# Altium project COM.PrjPcb (part 2 of 2)

## Sheet COM-MSP430FR5994.SchDoc: =DocumentName
size B; Date: June 22nd, 2018; Author: Radio Jesus; Engineer: Radio Jesus; Organization: Colorado Space Grant; Revision: A; SheetNumber: 3; SheetTotal: 7; ProjectName: COM-MSP430FR5994.SchDoc
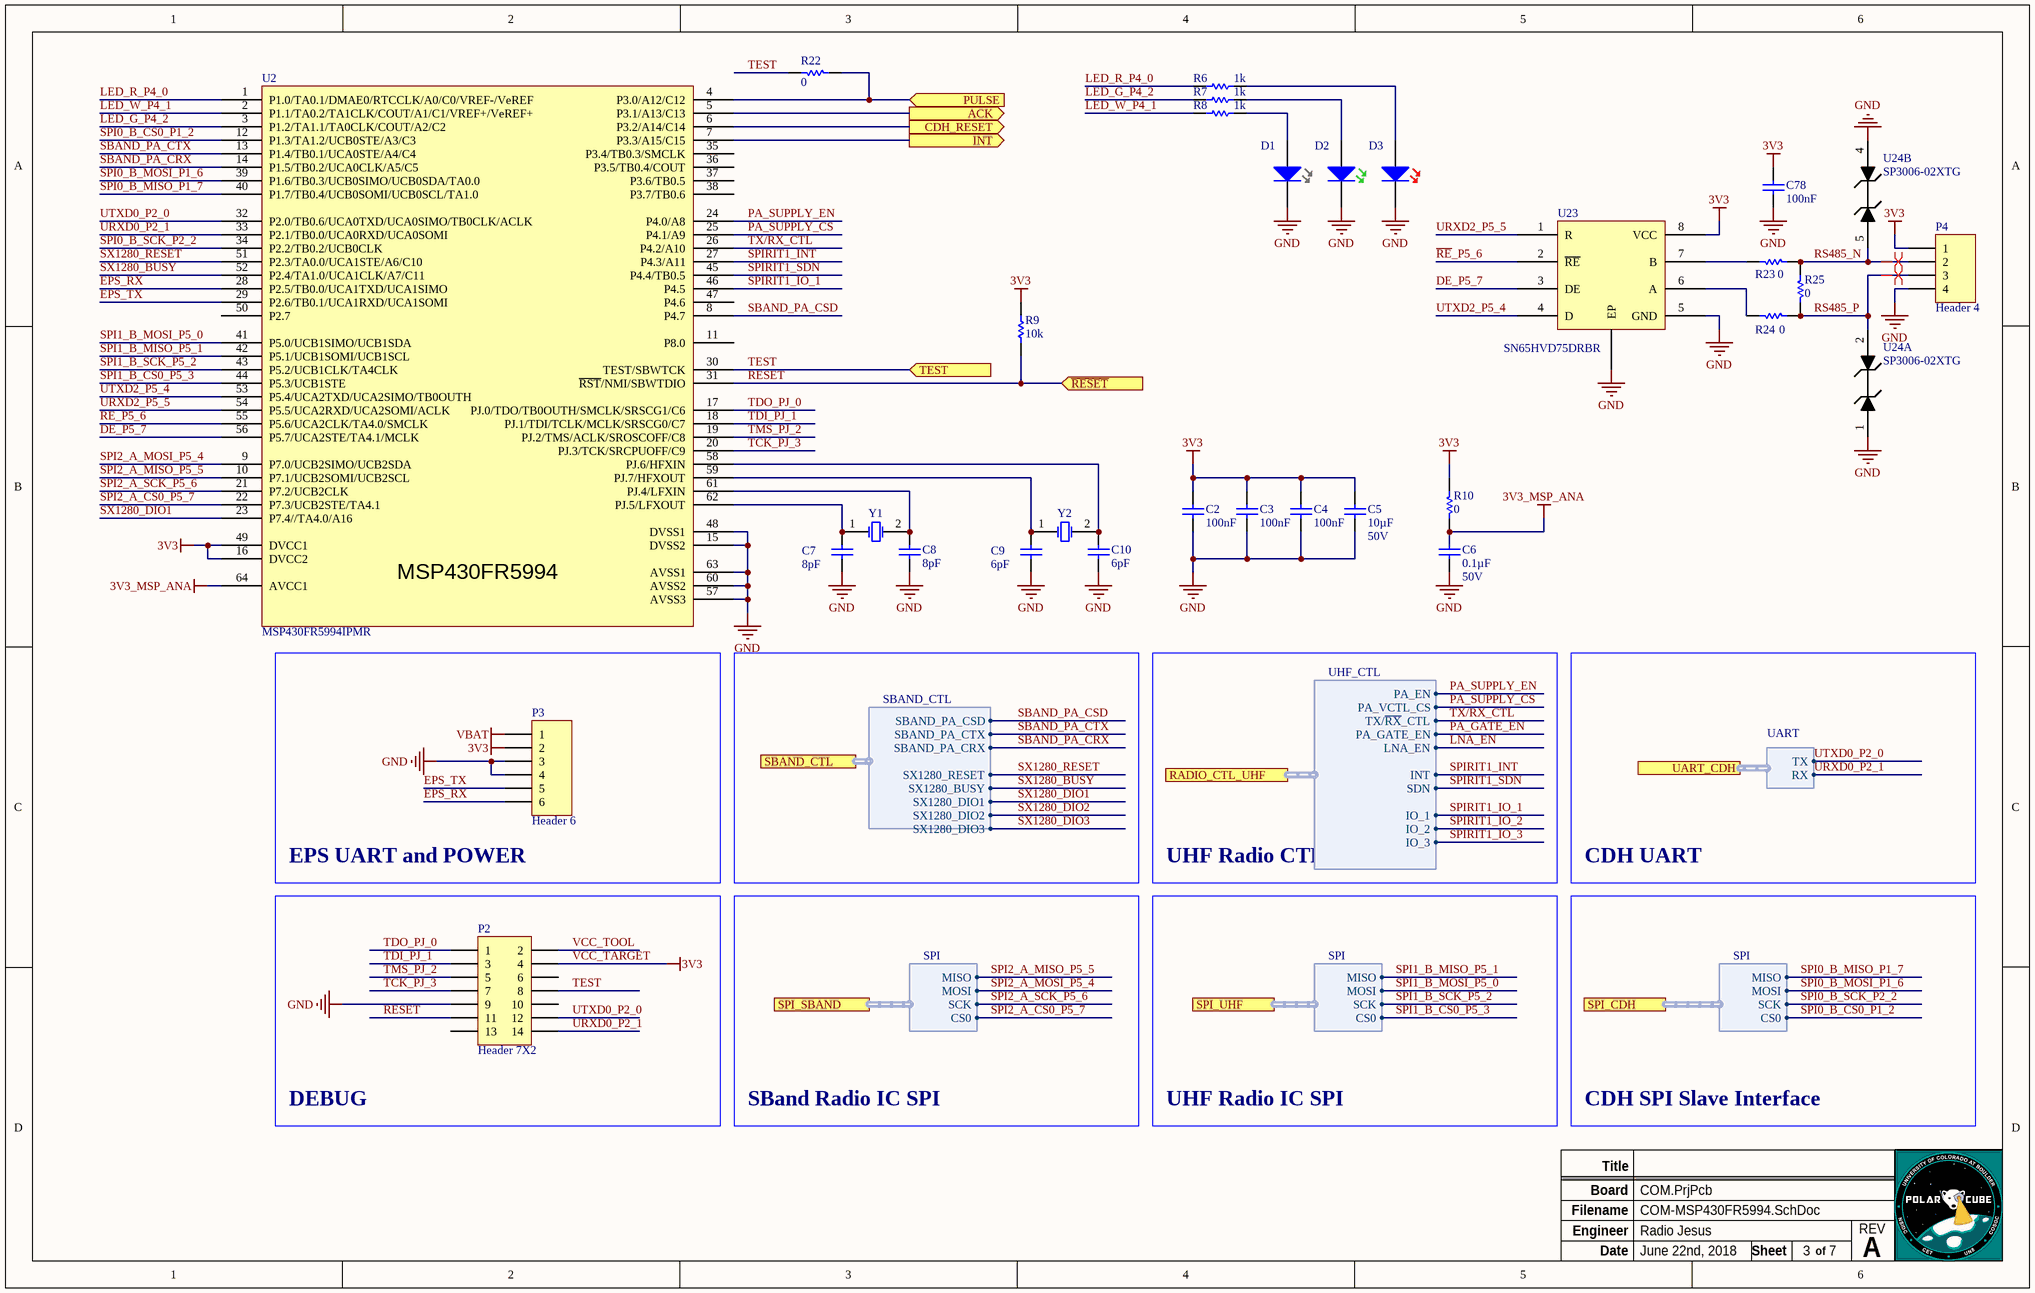
[diagram p6: COM-MSP430FR5994.SchDoc]

### Parts
C2  Capacitance: 100nF  [1608[0603]]  (hidden comment: CL10B104KB8ZW6C)
C3  Capacitance: 100nF  [1608[0603]]  (hidden comment: CL10B104KB8ZW6C)
C4  Capacitance: 100nF  [1608[0603]]  (hidden comment: CL10B104KB8ZW6C)
C5  Capacitance: 10µF  Voltage: 50V  [1608[0603]]  (hidden comment: CL10A106KP8NNNC)
C6  Capacitance: 0.1µF  Voltage: 50V  [1608[0603]]  (hidden comment: CL10B104KB8ZW6C)
C7  Capacitance: 8pF  [1608[0603]]  (hidden comment: CL10C080CB8NNNC)
C8  Capacitance: 8pF  [1608[0603]]  (hidden comment: CL10C080CB8NNNC)
C9  Capacitance: 6pF  [1608[0603]]  (hidden comment: CL10C060CB8NCNC)
C10  Capacitance: 6pF  [1608[0603]]  (hidden comment: CL10C060CB8NCNC)
C78  Capacitance: 100nF  [CAPC0603X03L]  (hidden comment: CL10B104KB8ZW6C)
D1  QBLP601-IW  [1608[0603]]  (value not drawn)
D2  150060VS75000  [1608[0603]]  (value not drawn)
D3  150060RS75000  [1608[0603]]  (value not drawn)
P2  Header 7X2  [MSP430_JTAG_HEADER]
P3  Header 6  [T1M-06-F-SV-L]
P4  Header 4  [FH34SRJ-4S-0.5SH(99)]
R6  Resistance: 1k  [1608[0603]]  (hidden comment: RMCF0603JT1K00)
R7  Resistance: 1k  [1608[0603]]  (hidden comment: RMCF0603JT1K00)
R8  Resistance: 1k  [1608[0603]]  (hidden comment: RMCF0603JT1K00)
R9  Resistance: 10k  [1608[0603]]  (hidden comment: RMCF0603JG10K0)
R10  Resistance: 0  [1608[0603]]  (hidden comment: CRCW06030000Z0EAC)
R22  Resistance: 0  [1608[0603]]  (hidden comment: CRCW06030000Z0EAC)
R23  Resistance: 0  [RESC0603X03N]  (hidden comment: CRCW06030000Z0EAC)
R24  Resistance: 0  [RESC0603X03N]  (hidden comment: CRCW06030000Z0EAC)
R25  Resistance: 0  [RESC0603X03N]  (hidden comment: CRCW06030000Z0EAC)
U2  MSP430FR5994IPMR  [S-PQFP-G64]
U23  SN65HVD75DRBR  [SON65P300X100_HS-9N]
U24  SP3006-02XTG  [SOT50P160X60-6L]  (parts A,B of 2)
Y1  XTAL  [FC-135R]  (value not drawn)
Y2  XTAL  [NX3225GD]  (value not drawn)

### Blocks framed on the sheet
EPS UART and POWER: P3
DEBUG: P2

### Ports
ACK (out), CDH_RESET (out), INT (out), PULSE (in), RADIO_CTL_UHF (harness UHF_CTL), SBAND_CTL (harness SBAND_CTL), SPI_CDH (harness SPI), SPI_SBAND (harness SPI), SPI_UHF (harness SPI), TEST (in), UART_CDH (harness UART), ~{RESET} (in)

### Harnesses
UART: RX, TX
SPI: MISO, MOSI, SCK, CS0
UHF_CTL: PA_EN, PA_VCTL_CS, TX/~{RX}_CTL, INT, SDN, IO_1, IO_2, IO_3, PA_GATE_EN, LNA_EN
SBAND_CTL: SBAND_PA_CSD, SBAND_PA_CTX, SBAND_PA_CRX, SX1280_RESET, SX1280_BUSY, SX1280_DIO1, SX1280_DIO2, SX1280_DIO3

### Nets
3V3: C2.2 C3.2 C4.2 C5.2 C78.2 P2.4 P3.2 P4.1 R9.2 R10.1 U2.16(DVCC2) U2.49(DVCC1) U23.8(VCC)  [also labelled VCC_TARGET]
3V3_MSP_ANA: C6.2 R10.2 U2.64(AVCC1)
GND: C2.1 C3.1 C4.1 C5.1 C6.1 C7.1 C8.1 C9.1 C10.1 C78.1 D1.2(K) D2.2(K) D3.2(K) P2.9 P3.3 P3.4 P4.4 U2.15(DVSS2) U2.48(DVSS1) U2.57(AVSS3) U2.60(AVSS2) U2.63(AVSS1) U23.5(GND) U23.9(EP) U24.1 U24.4
VBAT: P3.1
DE_P5_7: U2.56(P5.7/UCA2STE/TA4.1/MCLK) U23.3(DE)
EPS_RX: P3.6 U2.28(P2.5/TB0.0/UCA1TXD/UCA1SIMO)
EPS_TX: P3.5 U2.29(P2.6/TB0.1/UCA1RXD/UCA1SOMI)
LED_G_P4_2: R7.1 U2.3(P1.2/TA1.1/TA0CLK/COUT/A2/C2)
LED_R_P4_0: R6.1 U2.1(P1.0/TA0.1/DMAE0/RTCCLK/A0/C0/VREF-/VeREF)
LED_W_P4_1: R8.1 U2.2(P1.1/TA0.2/TA1CLK/COUT/A1/C1/VREF+/VeREF+)
PA_SUPPLY_CS: U2.25(P4.1/A9) ; port RADIO_CTL_UHF.PA_VCTL_CS
PA_SUPPLY_EN: U2.24(P4.0/A8) ; port RADIO_CTL_UHF.PA_EN
~{RE}_P5_6: U2.55(P5.6/UCA2CLK/TA4.0/SMCLK) U23.2(~{RE})
~{RESET}: P2.11 R9.1 U2.31(~{RST}/NMI/SBWTDIO) ; port ~{RESET}
RS485_N: P4.2 R23.2 R25.2 U24.5
RS485_P: P4.3 R24.2 R25.1 U24.2
S_ACK: U2.5(P3.1/A13/C13) ; port ACK
S_CDH_RESET: U2.6(P3.2/A14/C14) ; port CDH_RESET
S_INT: U2.7(P3.3/A15/C15) ; port INT
S_PULSE: R22.2 U2.4(P3.0/A12/C12) ; port PULSE
SBAND_PA_CRX: U2.14(P1.5/TB0.2/UCA0CLK/A5/C5) ; port SBAND_CTL.SBAND_PA_CRX
SBAND_PA_CSD: U2.8(P4.7) ; port SBAND_CTL.SBAND_PA_CSD
SBAND_PA_CTX: U2.13(P1.4/TB0.1/UCA0STE/A4/C4) ; port SBAND_CTL.SBAND_PA_CTX
SPI0_B_CS0_P1_2: U2.12(P1.3/TA1.2/UCB0STE/A3/C3) ; port SPI_CDH.CS0  [project net S_CS0]
SPI0_B_MISO_P1_7: U2.40(P1.7/TB0.4/UCB0SOMI/UCB0SCL/TA1.0) ; port SPI_CDH.MISO  [project net S_MISO]
SPI0_B_MOSI_P1_6: U2.39(P1.6/TB0.3/UCB0SIMO/UCB0SDA/TA0.0) ; port SPI_CDH.MOSI  [project net S_MOSI]
SPI0_B_SCK_P2_2: U2.34(P2.2/TB0.2/UCB0CLK) ; port SPI_CDH.SCK  [project net S_SCK]
SPI1_B_CS0_P5_3: U2.44(P5.3/UCB1STE) ; port SPI_UHF.CS0
SPI1_B_MISO_P5_1: U2.42(P5.1/UCB1SOMI/UCB1SCL) ; port SPI_UHF.MISO
SPI1_B_MOSI_P5_0: U2.41(P5.0/UCB1SIMO/UCB1SDA) ; port SPI_UHF.MOSI
SPI1_B_SCK_P5_2: U2.43(P5.2/UCB1CLK/TA4CLK) ; port SPI_UHF.SCK
SPI2_A_CS0_P5_7: U2.22(P7.3/UCB2STE/TA4.1) ; port SPI_SBAND.CS0
SPI2_A_MISO_P5_5: U2.10(P7.1/UCB2SOMI/UCB2SCL) ; port SPI_SBAND.MISO
SPI2_A_MOSI_P5_4: U2.9(P7.0/UCB2SIMO/UCB2SDA) ; port SPI_SBAND.MOSI
SPI2_A_SCK_P5_6: U2.21(P7.2/UCB2CLK) ; port SPI_SBAND.SCK
SPIRIT1_INT: U2.27(P4.3/A11) ; port RADIO_CTL_UHF.INT
SPIRIT1_IO_1: U2.46(P4.5) ; port RADIO_CTL_UHF.IO_1
SPIRIT1_SDN: U2.45(P4.4/TB0.5) ; port RADIO_CTL_UHF.SDN
SX1280_BUSY: U2.52(P2.4/TA1.0/UCA1CLK/A7/C11) ; port SBAND_CTL.SX1280_BUSY
SX1280_DIO1: U2.23(P7.4//TA4.0/A16) ; port SBAND_CTL.SX1280_DIO1
SX1280_RESET: U2.51(P2.3/TA0.0/UCA1STE/A6/C10) ; port SBAND_CTL.SX1280_RESET
TCK_PJ_3: P2.7 U2.20(PJ.3/TCK/SRCPUOFF/C9)
TDI_PJ_1: P2.3 U2.18(PJ.1/TDI/TCLK/MCLK/SRSCG0/C7)
TDO_PJ_0: P2.1 U2.17(PJ.0/TDO/TB0OUTH/SMCLK/SRSCG1/C6)
TEST: P2.8 R22.1 U2.30(TEST/SBWTCK) ; port TEST
TMS_PJ_2: P2.5 U2.19(PJ.2/TMS/ACLK/SROSCOFF/C8)
TX/~{RX}_CTL: U2.26(P4.2/A10) ; port RADIO_CTL_UHF.TX/~{RX}_CTL
URXD0_P2_1: P2.14 U2.33(P2.1/TB0.0/UCA0RXD/UCA0SOMI) ; port UART_CDH.RX  [project net S_RX]
URXD2_P5_5: U2.54(P5.5/UCA2RXD/UCA2SOMI/ACLK) U23.1(R)
UTXD0_P2_0: P2.12 U2.32(P2.0/TB0.6/UCA0TXD/UCA0SIMO/TB0CLK/ACLK) ; port UART_CDH.TX  [project net S_TX]
UTXD2_P5_4: U2.53(P5.4/UCA2TXD/UCA2SIMO/TB0OUTH) U23.4(D)
VCC_TOOL: P2.2
NetC7_2: C7.2 U2.62(PJ.5/LFXOUT) Y1.1(OSC1)
NetC8_2: C8.2 U2.61(PJ.4/LFXIN) Y1.2(OSC2)
NetC9_2: C9.2 U2.59(PJ.7/HFXOUT) Y2.1(OSC1)
NetC10_2: C10.2 U2.58(PJ.6/HFXIN) Y2.2(OSC2)
NetD1_1: D1.1(A) R8.2
NetD2_1: D2.1(A) R7.2
NetD3_1: D3.1(A) R6.2
NetR23_1: R23.1 U23.7(B)
NetR24_1: R24.1 U23.6(A)

Not connected (* = marked no-connect by the designer): P2 6 10 13; U2 11(P8.0) 35(P3.4/TB0.3/SMCLK) 36(P3.5/TB0.4/COUT) 37(P3.6/TB0.5) 38(P3.7/TB0.6) 47(P4.6) 50(P2.7)

### Layout directives
differential pair: RS485_N, RS485_P

### Notes on the sheet
- UHF Radio CTL
- CDH UART
- SBand Radio IC SPI
- UHF Radio IC SPI
- CDH SPI Slave Interface
- Title
- Board
- Date
- Engineer
- Filename
- Sheet
- of
- REV
- (in symbol MSP430FR5994IPMR) MSP430FR5994

### Library data of the parts
C2-C4 C6 C78 = 5022: MLCC 1608(0603) X7R 100NF 10% 50; PartNumber: CGA3E2X7R1H104K080AA; Manufacturer: TDK; ID: 5022; Category: Ceramic; Status: Unchecked; Tolerance: ±10%; Package: 0603 (1608 Metric); ComponentLink1Description: Datasheet; ComponentLink1URL: http://product.tdk.com/capacitor/mlcc/en/documents/mlcc_automotive_general_en.pdf
C5 = 5022: CAP CER 10UF 10V X5R 0603; PartNumber: CGA3E2X7R1H104K080AA; Manufacturer: TDK; ID: 5022; Tolerance: ±10%; Category: Ceramic; Status: Unchecked; Package: 0603 (1608 Metric); ComponentLink1Description: Datasheet; ComponentLink1URL: http://product.tdk.com/capacitor/mlcc/en/documents/mlcc_automotive_general_en.pdf
C7 C8 = 5022: CAP CER 8PF 50V C0G/NP0 0603; PartNumber: CGA3E2X7R1H104K080AA; Manufacturer: TDK; ID: 5022; Tolerance: ±10%; Category: Ceramic; Status: Unchecked; Package: 0603 (1608 Metric); ComponentLink1Description: Datasheet; ComponentLink1URL: http://product.tdk.com/capacitor/mlcc/en/documents/mlcc_automotive_general_en.pdf
C9 C10 = 5022: CAP CER 6PF 50V C0G/NP0 0603; PartNumber: CGA3E2X7R1H104K080AA; Manufacturer: TDK; ID: 5022; Tolerance: ±10%; Category: Ceramic; Status: Unchecked; Package: 0603 (1608 Metric); ComponentLink1Description: Datasheet; ComponentLink1URL: http://product.tdk.com/capacitor/mlcc/en/documents/mlcc_automotive_general_en.pdf
D1 = 27216: White LED Indication - Discrete 3.2V 0603 (1608 Metric); PartNumber: SMLP13WBC8W; Manufacturer: Rohm Semiconductor; ID: 27216; Avg Current: 5mA; Vf: 2.9; Param3: 0402; Category: LED; Status: Unchecked; ComponentLink1Description: Datasheet; ComponentLink1URL: http://media.digikey.com/pdf/Data%20Sheets/Rohm%20PDFs/SML-P1_Series_RevC.pdf
D2 = 27128: Green 570nm LED Indication - Discrete 2V 0603 (1608 Metric); PartNumber: SML-P11MTT86; Manufacturer: Rohm Semiconductor; ID: 27128; Avg Current: 1mA; Vf: 1.9; Param3: 0402; Category: LED; Status: Unchecked; ComponentLink1Description: Datasheet; ComponentLink1URL: http://rohmfs.rohm.com/en/products/databook/datasheet/opto/led/chip_mono/sml-p11_p-eco.pdf
D3 = 27130: Red 625nm LED Indication - Discrete 2V 0603 (1608 Metric); PartNumber: SML-P11UTT86; Manufacturer: Rohm Semiconductor; ID: 27130; Avg Current: 1mA; Vf: 1.8; Param3: 0402; Category: LED; Status: Unchecked; ComponentLink1Description: Datasheet; ComponentLink1URL: http://rohmfs.rohm.com/en/products/databook/datasheet/opto/led/chip_mono/sml-p11_p-eco.pdf
P2 = Header 7X2: Header, 7-Pin, Dual row; LatestRevisionDate: 17-Jul-2002; LatestRevisionNote: Re-released for DXP Platform.; Publisher: Altium Limited
P3 = Header 6: Header, 6-Pin; LatestRevisionDate: 17-Jul-2002; LatestRevisionNote: Re-released for DXP Platform.; Publisher: Altium Limited
P4 = Header 4: Header, 4-Pin; LatestRevisionDate: 17-Jul-2002; LatestRevisionNote: Re-released for DXP Platform.; Publisher: Altium Limited
R6-R8 = 28550: RES 1K OHM 5% 1/10W 0603; PartNumber: ERJ-2GEJ102X; Manufacturer: Panasonic; ID: 28550; Power: 0.1W, 1/10W; Category: General Purpose; Status: Unchecked; Tolerance: ±5%; Package: 0402 (1005 Metric); ComponentLink1Description: Datasheet; ComponentLink1URL: http://www.vishay.com/docs/20052/crcw0201e3.pdf
R9 = 20997: 10 kOhms ±5% 0.1W, 1/10W Chip Resistor 0603 (1608 Metric) Automotive AEC-Q200 Thick Film; PartNumber: CRCW060310K0FKEA; Manufacturer: Vishay; ID: 20997; Tolerance: 1%; Category: General Purpose; Status: Unchecked; Power: 0.1W, 1/10W; Package: 0603 (1608 Metric); ComponentLink1Description: Datasheet; ComponentLink1URL: http://www.vishay.com/doc?20035
R10 R22-R25 = 20997: RES SMD 0 OHM JUMP 1/10W 0603; PartNumber: CRCW060310K0FKEA; Manufacturer: Vishay; ID: 20997; Power: 0.1W, 1/10W; Tolerance: 1%; Category: General Purpose; Status: Unchecked; Package: 0603 (1608 Metric); ComponentLink1Description: Datasheet; ComponentLink1URL: http://www.vishay.com/doc?20035
U2 = MSP430FR5994IPMR: CPUXV2 MSP430™ FRAM Microcontroller IC 16-Bit 16MHz 256KB (256K x 8) FRAM 64-LQFP (10x10)
U24 = SP3006-02XTG: TVS DIODE 6V 15V SOT563
Y1 Y2 = XTAL: Crystal Oscillator; Published: 8-Jun-2000; LatestRevisionDate: 17-Jul-2002; LatestRevisionNote: Re-released for DXP Platform.; PackageReference: R38; Publisher: Altium Limited; PackageDescription: Crystal, Thru-Hole; 2 Leads; Body 3.1 x 8.2 mm (Dia.xH)

## Nets that join several sheets
1V8: COM-Radio-SBand (U20.4), COM-Radio-UHF (C21.2 R18.1 U8.5)
3V3: COM-CDH (J3.1), COM-Isolators (9 pins), COM-Radio-SBand (16 pins), COM-Radio-UHF (14 pins), COM-MSP430FR5994 (13 pins)
GND: COM-TopLevel (9 pins), COM-CDH (17 pins), COM-Isolators (21 pins), COM-Radio-SBand (61 pins), COM-Radio-UHF (54 pins), COM-MSP430FR5994 (26 pins)
ISO_3V3: COM-TopLevel (R1.1 U1.7 U1.8), COM-CDH (P1.20), COM-Isolators (11 pins)
VBAT: COM-CDH (J4.1), COM-Radio-UHF (C18.2 U7.1 U9.2), COM-MSP430FR5994 (P3.1)
M_ACK: COM-CDH (P1.18), COM-Isolators (U5.5)
M_CDH_RESET: COM-CDH (P1.34), COM-Isolators (U6.13)
M_CS0: COM-CDH (P1.28), COM-Isolators (U3.4 U4.2)
M_INT: COM-CDH (P1.30), COM-Isolators (U6.12)
M_MISO: COM-CDH (P1.31), COM-Isolators (U3.6)
M_MOSI: COM-CDH (P1.27), COM-Isolators (U3.5)
M_PULSE: COM-CDH (P1.17), COM-Isolators (U5.4)
M_RESET: COM-CDH (P1.36), COM-Isolators (U6.11)
M_RX: COM-CDH (R4.2 R5.2), COM-Isolators (U5.3)
M_SCK: COM-CDH (P1.23), COM-Isolators (U3.3)
M_TX: COM-CDH (R2.2 R3.2), COM-Isolators (U5.6)
PA_SUPPLY_CS: COM-Radio-UHF (U10.6), COM-MSP430FR5994 (U2.25)
PA_SUPPLY_EN: COM-Radio-UHF (U9.1), COM-MSP430FR5994 (U2.24)
~{RESET}: COM-Isolators (U6.6), COM-MSP430FR5994 (P2.11 R9.1 U2.31)
S_ACK: COM-Isolators (U5.12), COM-MSP430FR5994 (U2.5)
S_CDH_RESET: COM-Isolators (U6.4), COM-MSP430FR5994 (U2.6)
S_CS0: COM-Isolators (U3.13), COM-MSP430FR5994 (U2.12)
S_INT: COM-Isolators (U6.5), COM-MSP430FR5994 (U2.7)
S_MISO: COM-Isolators (U3.11), COM-MSP430FR5994 (U2.40)
S_MOSI: COM-Isolators (U3.12), COM-MSP430FR5994 (U2.39)
S_PULSE: COM-Isolators (U5.13), COM-MSP430FR5994 (R22.2 U2.4)
S_RX: COM-Isolators (U5.14), COM-MSP430FR5994 (P2.14 U2.33)
S_SCK: COM-Isolators (U3.14), COM-MSP430FR5994 (U2.34)
S_TX: COM-Isolators (U5.11), COM-MSP430FR5994 (P2.12 U2.32)
SBAND_PA_CRX: COM-Radio-SBand (U22.3), COM-MSP430FR5994 (U2.14)
SBAND_PA_CSD: COM-Radio-SBand (U22.1), COM-MSP430FR5994 (U2.8)
SBAND_PA_CTX: COM-Radio-SBand (U22.2), COM-MSP430FR5994 (U2.13)
SPI1_B_CS0_P5_3: COM-Radio-UHF (U12.5), COM-MSP430FR5994 (U2.44)
SPI1_B_MISO_P5_1: COM-Radio-UHF (U12.2), COM-MSP430FR5994 (U2.42)
SPI1_B_MOSI_P5_0: COM-Radio-UHF (U10.5 U12.3), COM-MSP430FR5994 (U2.41)
SPI1_B_SCK_P5_2: COM-Radio-UHF (U10.4 U12.4), COM-MSP430FR5994 (U2.43)
SPI2_A_CS0_P5_7: COM-Radio-SBand (U19.19), COM-MSP430FR5994 (U2.22)
SPI2_A_MISO_P5_5: COM-Radio-SBand (U19.16), COM-MSP430FR5994 (U2.10)
SPI2_A_MOSI_P5_4: COM-Radio-SBand (U19.17), COM-MSP430FR5994 (U2.9)
SPI2_A_SCK_P5_6: COM-Radio-SBand (U19.18), COM-MSP430FR5994 (U2.21)
SPIRIT1_INT: COM-Radio-UHF (U12.1), COM-MSP430FR5994 (U2.27)
SPIRIT1_IO_1: COM-Radio-UHF (U12.20), COM-MSP430FR5994 (U2.46)
SPIRIT1_SDN: COM-Radio-UHF (U12.15), COM-MSP430FR5994 (U2.45)
SX1280_BUSY: COM-Radio-SBand (U19.7), COM-MSP430FR5994 (U2.52)
SX1280_DIO1: COM-Radio-SBand (U19.8), COM-MSP430FR5994 (U2.23)
SX1280_RESET: COM-Radio-SBand (U19.3), COM-MSP430FR5994 (U2.51)
TEMP_BUS: COM-TopLevel (U1.2), COM-CDH (P1.32)
TX/~{RX}_CTL: COM-Radio-UHF (U14.3), COM-MSP430FR5994 (U2.26)

## Assembly variants
AAPCB: not fitted C42 L13 R12 R14 R16